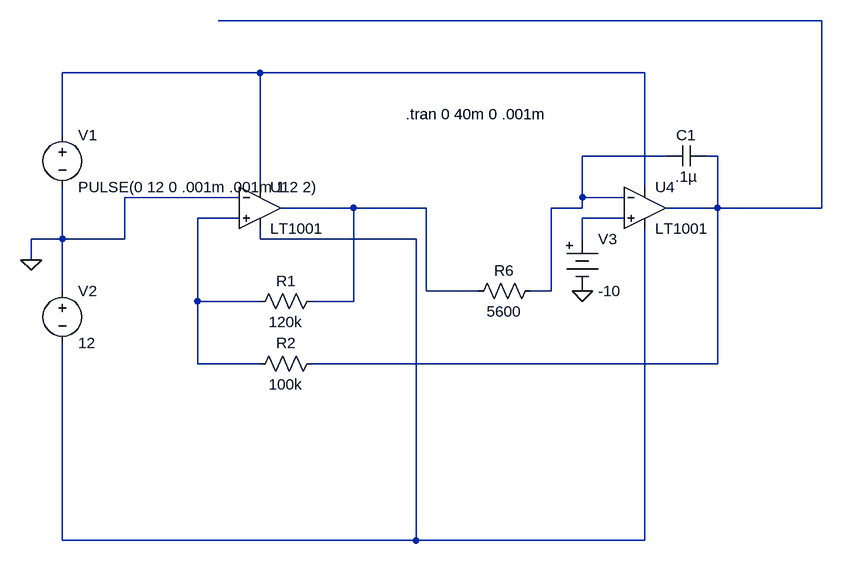
[diagram p0: schematic diente_de_sierra2.asc]
diente_de_sierra2.asc, the LTspice schematic file:
Version 4
SHEET 1 1188 680
WIRE 1024 -160 96 -160
WIRE 160 -80 -144 -80
WIRE 752 -80 160 -80
WIRE -144 16 -144 -80
WIRE 784 48 656 48
WIRE 864 48 848 48
WIRE 160 96 160 -80
WIRE 752 96 752 -80
WIRE 128 112 -48 112
WIRE 656 112 656 48
WIRE 720 112 656 112
WIRE 304 128 192 128
WIRE 416 128 304 128
WIRE 656 128 656 112
WIRE 656 128 608 128
WIRE 864 128 864 48
WIRE 864 128 784 128
WIRE 1024 128 1024 -160
WIRE 1024 128 864 128
WIRE 128 144 64 144
WIRE 720 144 656 144
WIRE -144 176 -144 96
WIRE -144 176 -192 176
WIRE -48 176 -48 112
WIRE -48 176 -144 176
WIRE 160 176 160 160
WIRE 400 176 160 176
WIRE 656 176 656 144
WIRE -192 208 -192 176
WIRE -144 256 -144 176
WIRE 416 256 416 128
WIRE 496 256 416 256
WIRE 608 256 608 128
WIRE 608 256 576 256
WIRE 64 272 64 144
WIRE 160 272 64 272
WIRE 304 272 304 128
WIRE 304 272 240 272
WIRE 64 368 64 272
WIRE 160 368 64 368
WIRE 864 368 864 128
WIRE 864 368 240 368
WIRE -144 640 -144 336
WIRE 400 640 400 176
WIRE 400 640 -144 640
WIRE 752 640 752 160
WIRE 752 640 400 640
FLAG -192 208 0
FLAG 656 256 0
SYMBOL Opamps\\LT1001 160 64 R0
SYMATTR InstName U1
SYMBOL voltage -144 0 R0
WINDOW 123 0 0 Left 2
WINDOW 39 0 0 Left 2
SYMATTR InstName V1
SYMATTR Value PULSE(0 12 0 .001m .001m 1 2 2)
SYMBOL voltage -144 240 R0
WINDOW 123 0 0 Left 2
WINDOW 39 0 0 Left 2
SYMATTR InstName V2
SYMATTR Value 12
SYMBOL res 592 240 R90
WINDOW 0 0 56 VBottom 2
WINDOW 3 32 56 VTop 2
SYMATTR InstName R6
SYMATTR Value 5600
SYMBOL Opamps\\LT1001 752 64 R0
SYMATTR InstName U4
SYMBOL cap 848 32 R90
WINDOW 0 0 32 VBottom 2
WINDOW 3 32 32 VTop 2
SYMATTR InstName C1
SYMATTR Value .1µ
SYMBOL res 256 256 R90
WINDOW 0 0 56 VBottom 2
WINDOW 3 32 56 VTop 2
SYMATTR InstName R1
SYMATTR Value 120k
SYMBOL res 256 352 R90
WINDOW 0 0 56 VBottom 2
WINDOW 3 32 56 VTop 2
SYMATTR InstName R2
SYMATTR Value 100k
SYMBOL Misc\\battery 656 160 R0
WINDOW 123 0 0 Left 2
WINDOW 39 0 0 Left 2
SYMATTR InstName V3
SYMATTR Value -10
TEXT 384 -16 Left 2 !.tran 0 40m 0 .001m

The netlist it stands for:
* diente_de_sierra2.asc
XU1 N005 0 N002 N007 N004 LT1001  ; pins In+ In- V+ V- OUT
V1 N002 0 PULSE(0 12 0 .001m .001m 1 2 2)
V2 0 N007 12
R6 N003 N004 5600
XU4 N006 N003 N002 N007 N001 LT1001  ; pins In+ In- V+ V- OUT
C1 N001 N003 .1µ
R1 N004 N005 120k
R2 N001 N005 100k
V3 N006 0 -10
.tran 0 40m 0 .001m
.lib LTC.lib
.backanno
.end